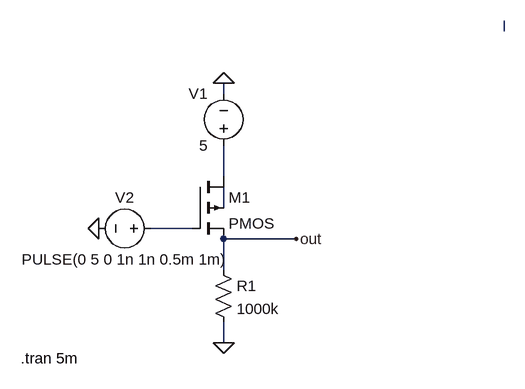
[diagram p0: schematic not_gate.asc]
not_gate.asc, the LTspice schematic file:
Version 4
SHEET 1 880 680
WIRE -48 -64 -48 -80
WIRE -480 32 -480 16
WIRE -480 160 -480 112
WIRE -480 208 -480 176
WIRE -528 240 -592 240
WIRE -368 256 -480 256
WIRE -480 304 -480 256
WIRE -480 416 -480 384
FLAG -480 416 0
FLAG -672 240 0
FLAG -480 16 0
FLAG -368 256 out
SYMBOL pmos4 -528 160 R0
SYMATTR InstName M1
SYMBOL res -496 288 R0
SYMATTR InstName R1
SYMATTR Value 1000k
SYMBOL voltage -576 240 R90
WINDOW 0 -32 56 VBottom 2
WINDOW 3 32 56 VTop 2
WINDOW 123 0 0 Left 0
WINDOW 39 0 0 Left 0
SYMATTR InstName V2
SYMATTR Value PULSE(0 5 0 1n 1n 0.5m 1m)
SYMBOL voltage -480 128 R180
WINDOW 0 24 96 Left 2
WINDOW 3 24 16 Left 2
WINDOW 123 0 0 Left 0
WINDOW 39 0 0 Left 0
SYMATTR InstName V1
SYMATTR Value 5
TEXT -792 440 Left 2 !.tran 5m

The netlist it stands for:
* not_gate.asc
M1 N002 N004 out N003 PMOS
R1 out 0 1000k
V2 N004 0 PULSE(0 5 0 1n 1n 0.5m 1m)
V1 N002 0 5
.model NMOS NMOS
.model PMOS PMOS
.lib standard.mos
.tran 5m
.backanno
.end